# Altium schematic sheet SATA.SchDoc
size A; DocumentNumber: 2; SheetNumber: 2; SheetTotal: 8
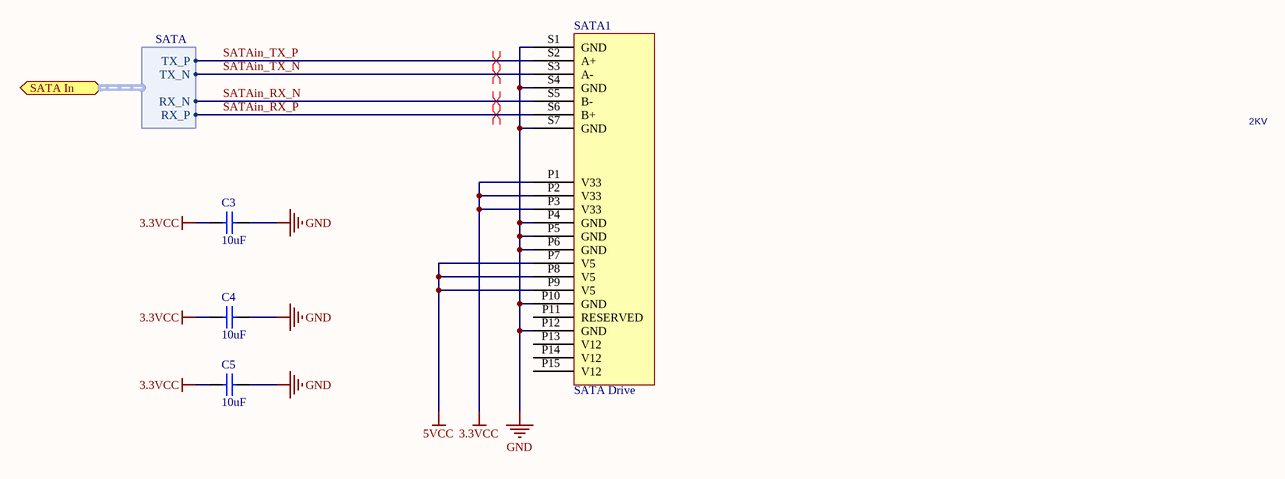
[diagram p0: SATA.SchDoc]

## Parts
C3  10uF  [1210 (3225) Capacitor]
C4  10uF  [1210 (3225) Capacitor]
C5  10uF  [1210 (3225) Capacitor]
SATA1  SATA Drive  [SandiskMini]

## Ports
SATA In (harness SATA)

## Harnesses
SATA: TX_P, TX_N, RX_N, RX_P

## Nets
3.3VCC: C3.2 C4.2 C5.2 SATA1.P1(V33) SATA1.P2(V33) SATA1.P3(V33)
5VCC: SATA1.P7(V5) SATA1.P8(V5) SATA1.P9(V5)
GND: C3.1 C4.1 C5.1 SATA1.P4(GND) SATA1.P5(GND) SATA1.P6(GND) SATA1.P10(GND) SATA1.P12(GND) SATA1.S1(GND) SATA1.S4(GND) SATA1.S7(GND)
SATAin_RX_N: SATA1.S5(B-) ; port SATA In.RX_N
SATAin_RX_P: SATA1.S6(B+) ; port SATA In.RX_P
SATAin_TX_N: SATA1.S3(A-) ; port SATA In.TX_N
SATAin_TX_P: SATA1.S2(A+) ; port SATA In.TX_P

Not connected (* = marked no-connect by the designer): SATA1 P11(RESERVED) P13(V12) P14(V12) P15(V12)

## Layout directives
differential pair: SATAin_RX_N, SATAin_RX_P, SATAin_TX_N, SATAin_TX_P

## Notes on the sheet
- 2KV

## Library data of the parts
C3-C5 = Capacitor (non-polarized): Capacitor; Value: 10nF; Digikey Part Number: Digi-Key; Supplier Part Number: 445-1401-1-ND; Supplier: Digi-Key
SATA1 = SATA Drive: SATA HDD, FCI Part# 10029364; Supplier Part Number: 609-1028-ND; Supplier: Digi-Key